# Altium schematic sheet TS-1088-AR02016.schdoc
size 127 x 101 mm
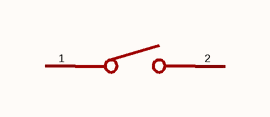
[diagram p0: TS-1088-AR02016.schdoc]

## Parts
SW?  ts-1088-ar02016  [SW-SMD_L3.9-W3.0-P4.45]  (value not drawn)

## Nets

Not connected (* = marked no-connect by the designer): SW? 1 2

## Library data of the parts
SW? = ts-1088-ar02016: 电路结构:单刀单掷;按钮形状:圆形按钮;作用力:1.6N;安装方式:立贴;开关长度:3.9mm;开关宽度:3mm;开关高度:2mm;带支架:不带支架;触点电流:50mA;额定电压:12V;带灯:-;工作寿命:10万次;; Manufacturer: XUNPU(讯普); AddInBom: yes; ModelId: b26698b69f274ffabef8a26c7d0e5dd1; ModelName: SW-SMD_L3.9-W2.9-H2.0-LS4.8; ModelTransform: 188.976,114.174,0,0,0,0,0,0,0; Circuit: 单刀单掷; Actuator Style: 圆形按钮; Operating Force: 1.6N; Switch Height: 2mm; with Bracket: 不带支架; Contact Current: 50mA; Voltage Rating: 12V; Actuator/Cap Color: 黑色; Life: 10万次; Symbol: TS-1088-AR02016; LCSC Part Name: 3.9*3*2mm 立贴 轻触开关; SupplierPart: C720477; ManufacturerPart: TS-1088-AR02016; Supplier Footprint: SMD,4x3mm; JLCPCB Part Class: Basic Part; Datasheet: https://item.szlcsc.com/datasheet/TS-1088-AR02016/763484.html; Supplier: LCSC; ConvertToPcb: yes; FootprintName: SW-SMD_L3.9-W3.0-P4.45; Mounting Type: 立贴; Length: 3.9mm; Width: 3mm; With Lamp: -; IP Rating: -; Termination Style: SMD接片; Operating Temperature: -30℃~+80℃